# Altium schematic sheet sata_m2.SchDoc
size A4; SheetNumber: 15; SheetTotal: 21
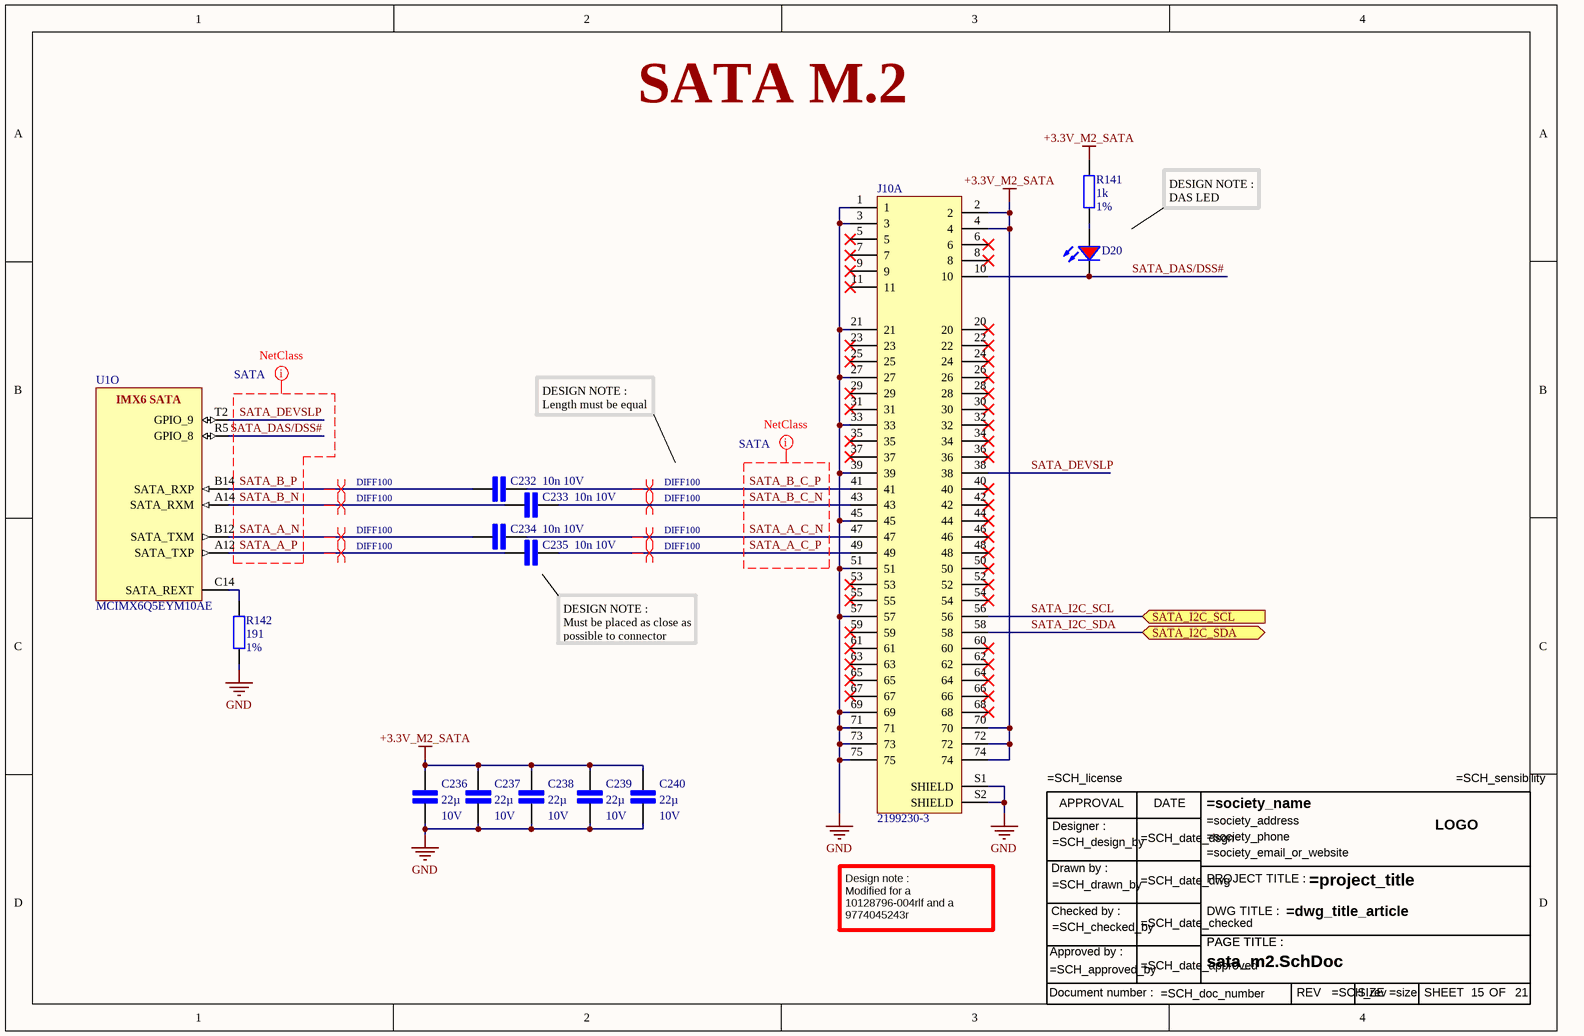
[diagram p0: sata_m2.SchDoc]

## Parts
C232  10n  Tension du diélectrique: 10V  [CAP CER 0201/0603]
C233  10n  Tension du diélectrique: 10V  [CAP CER 0201/0603]
C234  10n  Tension du diélectrique: 10V  [CAP CER 0201/0603]
C235  10n  Tension du diélectrique: 10V  [CAP CER 0201/0603]
C236  22µ  Tension du diélectrique: 10V  [Cap cer 0603/4608]
C237  22µ  Tension du diélectrique: 10V  [Cap cer 0603/4608]
C238  22µ  Tension du diélectrique: 10V  [Cap cer 0603/4608]
C239  22µ  Tension du diélectrique: 10V  [Cap cer 0603/4608]
C240  22µ  Tension du diélectrique: 10V  [Cap cer 0603/4608]
D20  Red, 2V, 120deg  [LED red 0603]  (value not drawn)
J10  2199230-3  [SATA_M2_ 2199230-3]  (part A of 2)
R141  1k  pourcentage: 1%  [Res 0402/1005]
R142  191  pourcentage: 1%  [Res 0402/1005]
TB14  Title bloc ANSI modified  (value not drawn)
U1  MCIMX6Q5EYM10AE  [FRES-2197-01]  (part O of 21)

## Ports
SATA_I2C_SCL (in), SATA_I2C_SDA (bidir)

## Nets
+3.3V_M2_SATA: C236.1 C237.1 C238.1 C239.1 C240.1 J10.2 J10.4 J10.70 J10.72 J10.74 R141.2
GND: C236.2 C237.2 C238.2 C239.2 C240.2 J10.1 J10.3 J10.21 J10.27 J10.33 J10.39 J10.45 J10.51 J10.57 J10.69 J10.71 J10.73 J10.75 J10.S1(SHIELD) J10.S2(SHIELD) R142.1
SATA_A_C_N: C234.2 J10.47
SATA_A_C_P: C235.2 J10.49
SATA_A_N: C234.1 U1.B12(SATA_TXM)
SATA_A_P: C235.1 U1.A12(SATA_TXP)
SATA_B_C_N: C233.2 J10.43
SATA_B_C_P: C232.2 J10.41
SATA_B_N: C233.1 U1.A14(SATA_RXM)
SATA_B_P: C232.1 U1.B14(SATA_RXP)
SATA_DAS/DSS#: D20.1(K) J10.10 U1.R5(GPIO_8)
SATA_DEVSLP: J10.38 U1.T2(GPIO_9)
SATA_I2C_SCL: J10.56 ; port SATA_I2C_SCL
SATA_I2C_SDA: J10.58 ; port SATA_I2C_SDA
NetD20_2: D20.2(A) R141.1
NetR142_2: R142.2 U1.C14(SATA_REXT)

Not connected (* = marked no-connect by the designer): J10 5* 6* 7* 8* 9* 11* 20* 22* 23* 24* 25* 26* 28* 29* 30* 31* 32* 34* 35* 36* 37* 40* 42* 44* 46* 48* 50* 52* 53* 54* 55* 59* 60* 61* 62* 63* 64* 65* 66* 67* 68*

## Layout directives
differential pair; differential pair class DIFF100: SATA_A_C_N, SATA_A_C_P, SATA_A_N, SATA_A_P, SATA_B_C_N, SATA_B_C_P, SATA_B_N, SATA_B_P
net class SATA: SATA_A_C_N, SATA_A_C_P, SATA_A_N, SATA_A_P, SATA_B_C_N, SATA_B_C_P, SATA_B_N, SATA_B_P, SATA_DEVSLP

## Notes on the sheet
- SATA M.2
- DESIGN NOTE :
  DAS LED
- DESIGN NOTE :
  Length must be equal
- DESIGN NOTE :
  Must be placed as close as possible to connector
- Design note :
  Modified for a 10128796-004rlf and a 9774045243r
- (in symbol IMX6Q5EYM10AE, part O) IMX6 SATA
- (in symbol Title bloc ANSI) APPROVAL; DATE; Designer :; LOGO; Drawn by :; PROJECT TITLE :; Checked by :; DWG TITLE :; PAGE TITLE :; Approved by :; Document number :; REV; SIZE; SHEET; OF

## Library data of the parts
C232-C235 = cap 10n 10V: cap ceramique 10n 10V 10% 0201; Diélectrique: X5R
C236-C240 = cap 22µ 10V: cap cer 22µ 10V 10% X5R 0603; Diélectrique: X5R
D20 = LED Red 0603: WL-SMCC SMD Mono-color Chip LED Compact, size 0603, Red, 2V, 120deg 150060RS73220; Dominant Wavelength: 624nm; Luminous Intensity: 90mcd; Peak Wavelength: 632nm; Chip Technology: AlInGaP; ComponentLink1URL: http://www.we-online.de; ComponentLink2Description: Datasheet; ComponentLink2URL: https://katalog.we-online.com/led/datasheet/150060RS73220.pdf; Part Number: 150060RS73220; Published Date: July 2019; Publisher: Wurth Elektronik; Size: 0603; Viewing Angle: 120deg; Packaging: Tape and Reel; Emitting Color: Red; Mounting Technology: SMT; Forward Voltage: 2V; Operating Temperature: -40 to +85degC
J10 = SATA_M.2_2199230-3 / multi interface: Combined component with SATA M.2 and external card connector (M.2 format too) / ref : / 2199230-4 / 2199230-3
R141 = res 1k 1%: res 1k 1% 0402
R142 = res 191 1%: res 191 ohm 1% 0402
TB14 = Title bloc ANSI
U1 = IMX6Q5EYM10AE: 32-Bit i.MX 6 Quad Application Processor, 1 GHz, 256 KB RAM, Extended Consumer Grade, 624-Pin FCPBGA, RoHS, Tape and Reel; PartNumber: MCIMX6Q5EYM10ACR; Manufacturer: Freescale Semiconductor; CAN: FlexCAN; Number of Cores: 4 Spec; External Memory Supported: DDR3, DDR3L, FLASH, LPDDR2; Speed Grade: 1 GHz; Core Type: ARM Cortex A9; Cache (KB): 32; Ethernet: 1 Gbps + IEEE 1588; Internal RAM (KB): 256; ComponentLink1Description: Manufacturer URL; ComponentLink2Description: Datasheet; DatasheetVersion: Rev. 2.3; ComponentLink3URL: http://cache.freescale.com/files/32bit/doc/data_sheet/IMX6DQCEC.pdf?fpsp=1&WT_TYPE=Data%20Sheets&WT_VENDOR=FREESCALE&WT_FILE_FORMAT=pdf&WT_ASSET=Documentation; ComponentLink1URL: http://www.freescale.com/; Packing: Tape and Reel; Temperature Range: -20 to 105 degC; ComponentLink2URL: http://cache.freescale.com/files/32bit/doc/data_sheet/IMX6DQCEC.pdf?fpsp=1&WT_TYPE=Data%20Sheets&WT_VENDOR=FREESCALE&WT_FILE_FORMAT=pdf&WT_ASSET=Documentation; ComponentLink3Description: Package Specification; PackageVersion: Rev. A; RoHS: TRUE; Quad/Dual CPU: i.MX 6Quad; Mounting Technology: Surface Mount; PackageReference: FCPBGA-624; PackageDescription: 624-pin Ball Grid Array Package, Body 21 x 21mm, Pitch 0.8mm